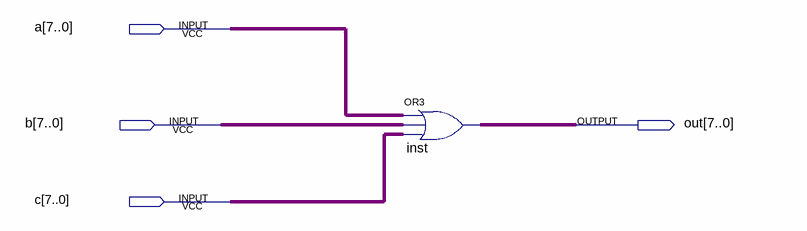
[diagram p0: schematic sheet]
// Quartus schematic test.bdf as structural Verilog: 1 symbols, 4 pins
module test (
  input  [7:0] a,
  input  [7:0] b,
  input  [7:0] c,
  output [7:0] out
);

  assign out = a | b | c;  // OR3 inst, 8 bits wide
endmodule
